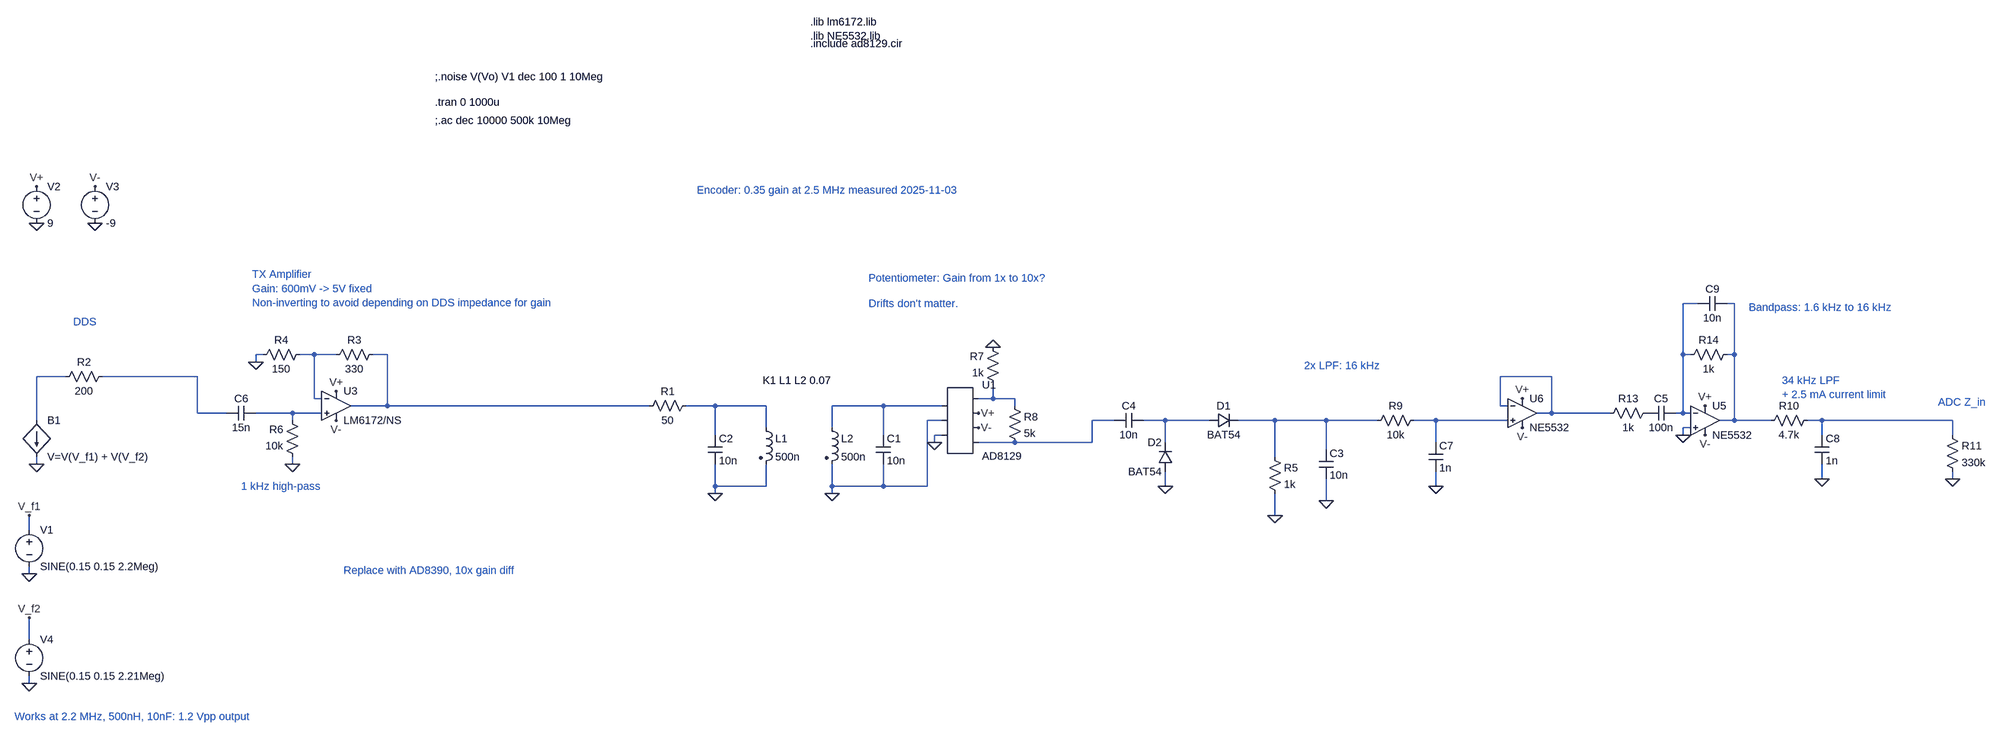
[diagram p0: schematic 2025-12-14_system-model_no-lo.asc]
2025-12-14_system-model_no-lo.asc, the LTspice schematic file:
Version 4
SHEET 1 4508 1504
WIRE 3552 -368 3520 -368
WIRE 3632 -368 3616 -368
WIRE 112 -256 96 -256
WIRE 224 -256 192 -256
WIRE 272 -256 224 -256
WIRE 384 -256 352 -256
WIRE 3520 -256 3520 -368
WIRE 3536 -256 3520 -256
WIRE 3632 -256 3632 -368
WIRE 3632 -256 3616 -256
WIRE 96 -240 96 -256
WIRE -320 -208 -384 -208
WIRE -32 -208 -240 -208
WIRE 3232 -208 3120 -208
WIRE 224 -160 224 -256
WIRE 240 -160 224 -160
WIRE 1856 -160 1856 -192
WIRE 1856 -160 1824 -160
WIRE 1904 -160 1856 -160
WIRE 384 -144 384 -256
WIRE 384 -144 304 -144
WIRE 1104 -144 384 -144
WIRE 1248 -144 1184 -144
WIRE 1360 -144 1248 -144
WIRE 1616 -144 1504 -144
WIRE 1744 -144 1616 -144
WIRE 1904 -144 1904 -160
WIRE 3120 -144 3120 -208
WIRE 3136 -144 3120 -144
WIRE -32 -128 -32 -208
WIRE 32 -128 -32 -128
WIRE 176 -128 96 -128
WIRE 240 -128 176 -128
WIRE 3232 -128 3232 -208
WIRE 3232 -128 3200 -128
WIRE 3360 -128 3232 -128
WIRE 3520 -128 3520 -256
WIRE 3520 -128 3504 -128
WIRE 3536 -128 3520 -128
WIRE -384 -112 -384 -208
WIRE 176 -112 176 -128
WIRE 1744 -112 1712 -112
WIRE 2208 -112 2160 -112
WIRE 2320 -112 2272 -112
WIRE 2416 -112 2320 -112
WIRE 2560 -112 2480 -112
WIRE 2672 -112 2560 -112
WIRE 2784 -112 2672 -112
WIRE 2912 -112 2864 -112
WIRE 3136 -112 2912 -112
WIRE 3632 -112 3632 -256
WIRE 3632 -112 3600 -112
WIRE 3712 -112 3632 -112
WIRE 3824 -112 3792 -112
WIRE 4208 -112 3824 -112
WIRE 1360 -96 1360 -144
WIRE 1504 -96 1504 -144
WIRE 3536 -96 3520 -96
WIRE 1248 -80 1248 -144
WIRE 1616 -80 1616 -144
WIRE 1744 -80 1728 -80
WIRE 3520 -80 3520 -96
WIRE 3824 -80 3824 -112
WIRE 4208 -80 4208 -112
WIRE 1728 -64 1728 -80
WIRE 1904 -64 1824 -64
WIRE 2160 -64 2160 -112
WIRE 2160 -64 1904 -64
WIRE 2320 -64 2320 -112
WIRE 2912 -64 2912 -112
WIRE 2672 -48 2672 -112
WIRE 2560 -32 2560 -112
WIRE -384 -16 -384 -32
WIRE 176 -16 176 -32
WIRE 3824 16 3824 -16
WIRE 4208 16 4208 0
WIRE 1248 32 1248 -16
WIRE 1360 32 1360 -16
WIRE 1360 32 1248 32
WIRE 1504 32 1504 -16
WIRE 1616 32 1616 -16
WIRE 1616 32 1504 32
WIRE 1712 32 1712 -112
WIRE 1712 32 1616 32
WIRE 2320 32 2320 0
WIRE 2912 32 2912 0
WIRE 1248 48 1248 32
WIRE 1504 48 1504 32
WIRE 2672 64 2672 16
WIRE 2560 96 2560 48
WIRE -400 128 -400 96
WIRE -400 224 -400 208
WIRE -400 368 -400 320
WIRE -400 464 -400 448
FLAG -384 -544 0
FLAG -384 -624 V+
FLAG -256 -544 0
FLAG -256 -624 V-
FLAG -400 224 0
FLAG 1504 48 0
FLAG 272 -176 V+
FLAG 272 -112 V-
FLAG 96 -240 0
FLAG 1248 48 0
FLAG 2560 96 0
FLAG 2672 64 0
FLAG 2320 32 0
FLAG -400 464 0
FLAG 3568 -144 V+
FLAG 3568 -80 V-
FLAG 3520 -80 0
FLAG 3168 -160 V+
FLAG 3168 -96 V-
FLAG -400 96 V_f1
FLAG -400 320 V_f2
FLAG -384 -16 0
FLAG 176 -16 0
FLAG 1824 -128 V+
FLAG 1824 -96 V-
FLAG 1728 -64 0
FLAG 1856 -272 0
FLAG 2912 32 0
FLAG 3824 16 0
FLAG 4208 16 0
SYMBOL Voltage -384 -640 R0
SYMATTR InstName V2
SYMATTR Value 9
SYMBOL Voltage -256 -640 R0
SYMATTR InstName V3
SYMATTR Value -9
SYMBOL Voltage -400 112 R0
SYMATTR InstName V1
SYMATTR Value SINE(0.15 0.15 2.2Meg)
SYMATTR Value2 AC 1
SYMBOL ind2 1344 -112 R0
SYMATTR InstName L1
SYMATTR Value 500n
SYMATTR Type ind
SYMATTR SpiceLine Rser=1
SYMBOL ind2 1488 -112 R0
SYMATTR InstName L2
SYMATTR Value 500n
SYMATTR Type ind
SYMATTR SpiceLine Rser=1
SYMBOL Cap 1600 -80 R0
SYMATTR InstName C1
SYMATTR Value 10n
SYMBOL Res 1200 -160 R90
WINDOW 0 0 56 VBottom 2
WINDOW 3 32 56 VTop 2
SYMATTR InstName R1
SYMATTR Value 50
SYMBOL Cap 1232 -80 R0
SYMATTR InstName C2
SYMATTR Value 10n
SYMBOL Res -224 -224 R90
WINDOW 0 0 56 VBottom 2
WINDOW 3 32 56 VTop 2
SYMATTR InstName R2
SYMATTR Value 200
SYMBOL Res 368 -272 R90
WINDOW 0 0 56 VBottom 2
WINDOW 3 32 56 VTop 2
SYMATTR InstName R3
SYMATTR Value 330
SYMBOL Res 208 -272 R90
WINDOW 0 0 56 VBottom 2
WINDOW 3 32 56 VTop 2
SYMATTR InstName R4
SYMATTR Value 150
SYMBOL Res 2544 -48 R0
SYMATTR InstName R5
SYMATTR Value 1k
SYMBOL Cap 2656 -48 R0
SYMATTR InstName C3
SYMATTR Value 10n
SYMBOL diode 2416 -96 R270
WINDOW 0 32 32 VTop 2
WINDOW 3 0 32 VBottom 2
SYMATTR InstName D1
SYMATTR Value BAT54
SYMBOL diode 2336 0 R180
WINDOW 0 24 64 Left 2
WINDOW 3 24 0 Left 2
SYMATTR InstName D2
SYMATTR Value BAT54
SYMBOL Cap 2272 -128 R90
WINDOW 0 0 32 VBottom 2
WINDOW 3 32 32 VTop 2
SYMATTR InstName C4
SYMATTR Value 10n
SYMBOL Voltage -400 352 R0
SYMATTR InstName V4
SYMATTR Value SINE(0.15 0.15 2.21Meg)
SYMATTR Value2 AC 1
SYMBOL OpAmps/opamp2 272 -208 R0
SYMATTR InstName U3
SYMATTR Value LM6172/NS
SYMBOL OpAmps/opamp2 3568 -176 R0
SYMATTR InstName U5
SYMATTR Value NE5532
SYMBOL Res 3456 -144 R90
WINDOW 0 0 56 VBottom 2
WINDOW 3 32 56 VTop 2
SYMATTR InstName R13
SYMATTR Value 1k
SYMBOL Cap 3504 -144 R90
WINDOW 0 0 32 VBottom 2
WINDOW 3 32 32 VTop 2
SYMATTR InstName C5
SYMATTR Value 100n
SYMBOL Res 3632 -272 R90
WINDOW 0 0 56 VBottom 2
WINDOW 3 32 56 VTop 2
SYMATTR InstName R14
SYMATTR Value 1k
SYMBOL OpAmps/opamp2 3168 -192 R0
SYMATTR InstName U6
SYMATTR Value NE5532
SYMBOL Cap 3616 -384 R90
WINDOW 0 0 32 VBottom 2
WINDOW 3 32 32 VTop 2
SYMATTR InstName C9
SYMATTR Value 10n
SYMBOL bi -384 -112 R0
SYMATTR InstName B1
SYMATTR Value V=V(V_f1) + V(V_f2)
SYMBOL Res 192 -16 R180
WINDOW 0 36 76 Left 2
WINDOW 3 36 40 Left 2
SYMATTR InstName R6
SYMATTR Value 10k
SYMBOL Cap 96 -144 R90
WINDOW 0 0 32 VBottom 2
WINDOW 3 32 32 VTop 2
SYMATTR InstName C6
SYMATTR Value 15n
SYMBOL AutoGenerated/AD8129 1776 -112 R0
SYMATTR InstName U1
SYMBOL Res 1872 -176 R180
WINDOW 0 36 76 Left 2
WINDOW 3 36 40 Left 2
SYMATTR InstName R7
SYMATTR Value 1k
SYMBOL Res 1888 -160 R0
SYMATTR InstName R8
SYMATTR Value 5k
SYMBOL Res 2880 -128 R90
WINDOW 0 0 56 VBottom 2
WINDOW 3 32 56 VTop 2
SYMATTR InstName R9
SYMATTR Value 10k
SYMBOL Cap 2896 -64 R0
SYMATTR InstName C7
SYMATTR Value 1n
SYMBOL Res 3808 -128 R90
WINDOW 0 0 56 VBottom 2
WINDOW 3 32 56 VTop 2
SYMATTR InstName R10
SYMATTR Value 4.7k
SYMBOL Cap 3808 -80 R0
SYMATTR InstName C8
SYMATTR Value 1n
SYMBOL Res 4192 -96 R0
SYMATTR InstName R11
SYMATTR Value 330k
TEXT -304 -328 Left 2 ;DDS
TEXT 88 -432 Left 2 ;TX Amplifier\nGain: 600mV -> 5V fixed\nNon-inverting to avoid depending on DDS impedance for gain
TEXT 1352 -200 Left 2 !K1 L1 L2 0.07
TEXT 1208 -616 Left 2 ;Encoder: 0.35 gain at 2.5 MHz measured 2025-11-03
TEXT 488 -864 Left 2 !.tran 0 1000u
TEXT 488 -920 Left 2 !;.noise V(Vo) V1 dec 100 1 10Meg
TEXT 488 -824 Left 2 !;.ac dec 10000 500k 10Meg
TEXT 1456 -1040 Left 2 !.lib lm6172.lib\n.lib NE5532.lib
TEXT 1584 -424 Left 2 ;Potentiometer: Gain from 1x to 10x?
TEXT -432 536 Left 2 ;Works at 2.2 MHz, 500nH, 10nF: 1.2 Vpp output
TEXT 1584 -368 Left 2 ;Drifts don't matter.
TEXT 3664 -360 Left 2 ;Bandpass: 1.6 kHz to 16 kHz
TEXT 64 32 Left 2 ;1 kHz high-pass
TEXT 288 216 Left 2 ;Replace with AD8390, 10x gain diff
TEXT 1456 -992 Left 2 !.include ad8129.cir
TEXT 3736 -200 Left 2 ;34 kHz LPF\n+ 2.5 mA current limit
TEXT 4176 -152 Left 2 ;ADC Z_in
TEXT 2624 -232 Left 2 ;2x LPF: 16 kHz

The netlist it stands for:
* 2025-12-14_system-model_no-lo.asc
V2 V+ 0 9
V3 V- 0 -9
V1 V_f1 0 SINE(0.15 0.15 2.2Meg) AC 1
L1 N009 0 500n Rser=1
L2 N010 0 500n Rser=1
C1 N010 0 10n
R1 N009 N004 50
C2 N009 0 10n
R2 N006 N005 200
R3 N004 N003 330
R4 N003 0 150
R5 N014 0 1k
C3 N014 0 10n
D1 N013 N014 BAT54
D2 0 N013 BAT54
C4 N013 N012 10n
V4 V_f2 0 SINE(0.15 0.15 2.21Meg) AC 1
XU3 N011 N003 V+ V- N004 LM6172/NS  ; pins In+ In- V+ V- OUT
XU5 0 N001 V+ V- N002 NE5532  ; pins In+ In- V+ V- OUT
R13 P001 N007 1k
C5 N001 P001 100n
R14 N002 N001 1k
XU6 N015 N007 V+ V- N007 NE5532  ; pins In+ In- V+ V- OUT
C9 N002 N001 10n
B1 N005 0 V=V(V_f1) + V(V_f2)
R6 0 N011 10k
C6 N011 N006 15n
* U1: AD8129 (symbol AutoGenerated/AD8129 not available, pins judged from their places): pin1=N010 pin2=0 pin3=0 pin4=N008 pin5=V+ pin6=V- pin7=N012
R7 N008 0 1k
R8 N008 N012 5k
R9 N015 N014 10k
C7 N015 0 1n
R10 N016 N002 4.7k
C8 N016 0 1n
R11 N016 0 330k
.model D D
.lib standard.dio
* DDS
* TX Amplifier
* Gain: 600mV -> 5V fixed
* Non-inverting to avoid depending on DDS impedance for gain
K1 L1 L2 0.07
* Encoder: 0.35 gain at 2.5 MHz measured 2025-11-03
.tran 0 1000u
;.noise V(Vo) V1 dec 100 1 10Meg
;.ac dec 10000 500k 10Meg
.lib lm6172.lib
.lib NE5532.lib
* Potentiometer: Gain from 1x to 10x?
* Works at 2.2 MHz, 500nH, 10nF: 1.2 Vpp output
* Drifts don't matter.
* Bandpass: 1.6 kHz to 16 kHz
* 1 kHz high-pass
* Replace with AD8390, 10x gain diff
.include ad8129.cir
* 34 kHz LPF
* + 2.5 mA current limit
* ADC Z_in
* 2x LPF: 16 kHz
.backanno
.end